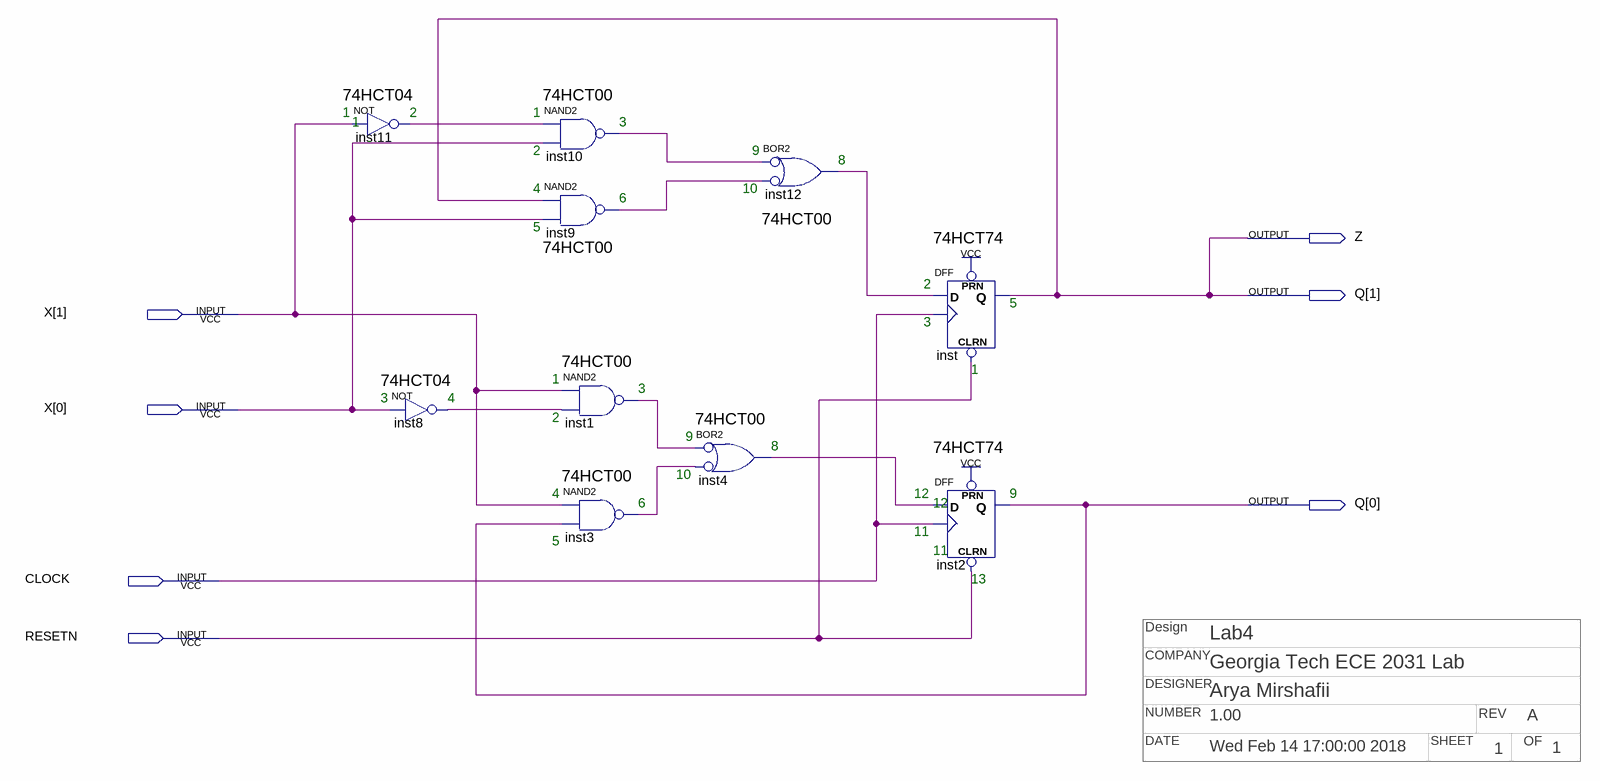
[diagram p0: schematic sheet]
// Quartus schematic SM_SCHEMATIC.bdf as structural Verilog: 10 symbols, 7 pins
// Title block: Design: Lab4; COMPANY: Georgia Tech ECE 2031 Lab; DESIGNER: Arya Mirshafii; NUMBER: 1.00; REV: A; DATE: Wed Feb 14 17:00:00 2018; SHEET: 1; OF: 1
module SM_SCHEMATIC (
  input  [1:0] X,
  input  CLOCK,
  input  RESETN,
  output Z,
  output [1:0] Q
);

  wire inst1_out, inst3_out, inst4_out, inst8_out, inst9_out, inst10_out, inst11_out, inst12_out;

  not inst11 (inst11_out, X[1]);
  not inst8 (inst8_out, X[0]);
  nand inst10 (inst10_out, inst11_out, X[0]);
  nand inst9 (inst9_out, Q[1], X[0]);
  nand inst1 (inst1_out, X[1], inst8_out);
  nand inst3 (inst3_out, X[1], Q[0]);
  or inst4 (inst4_out, ~inst1_out, ~inst3_out);  // BOR2
  or inst12 (inst12_out, ~inst10_out, ~inst9_out);  // BOR2
  DFF inst (.CLRN(RESETN), .CLK(CLOCK), .D(inst12_out), .PRN(1'b1), .Q(Q[1]));
  DFF inst2 (.CLRN(RESETN), .CLK(CLOCK), .D(inst4_out), .PRN(1'b1), .Q(Q[0]));

  assign Z = Q[1];

  // Notes on the sheet:
  //   74HCT04
  //   74HCT00
  //   1
  //   2
  //   1
  //   1
  //   3
  //   2
  //   9
  //   8
  //   4
  //   10
  //   6
  //   74HCT00
  //   5
  //   74HCT74
  //   74HCT00
  //   2
  //   5
  //   3
  //   74HCT00
  //   1
  //   74HCT04
  //   1
  //   3
  //   3
  //   4
  //   2
  //   74HCT00
  //   9
  //   8
  //   74HCT74
  //   74HCT00
  //   10
  //   4
  //   12
  //   9
  //   6
  //   12
  //   11
  //   5
  //   11
  //   13
endmodule
